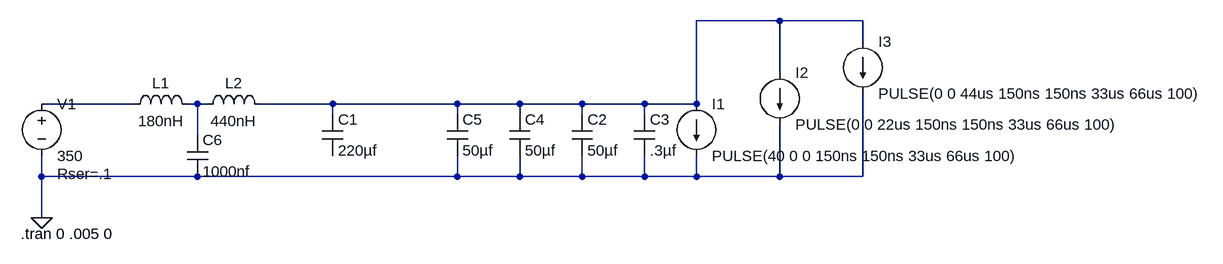
[diagram p0: schematic dc vus caps.asc]
dc vus caps.asc, the LTspice schematic file:
Version 4
SHEET 1 1480 680
WIRE 784 48 656 48
WIRE 912 48 784 48
WIRE 912 80 912 48
WIRE 784 128 784 48
WIRE -208 176 -352 176
WIRE -112 176 -128 176
WIRE -96 176 -112 176
WIRE 96 176 -16 176
WIRE 288 176 96 176
WIRE 384 176 288 176
WIRE 480 176 384 176
WIRE 576 176 480 176
WIRE 656 176 656 48
WIRE 656 176 576 176
WIRE 96 192 96 176
WIRE 288 192 288 176
WIRE 384 192 384 176
WIRE 480 192 480 176
WIRE 576 192 576 176
WIRE -112 224 -112 176
WIRE 96 256 96 240
WIRE -352 288 -352 256
WIRE -112 288 -352 288
WIRE 288 288 288 256
WIRE 288 288 -112 288
WIRE 384 288 384 256
WIRE 384 288 288 288
WIRE 480 288 480 256
WIRE 480 288 384 288
WIRE 576 288 576 256
WIRE 576 288 480 288
WIRE 656 288 656 256
WIRE 656 288 576 288
WIRE 784 288 784 208
WIRE 784 288 656 288
WIRE 912 288 912 160
WIRE 912 288 784 288
WIRE -352 352 -352 288
FLAG -352 352 0
SYMBOL voltage -352 160 R0
WINDOW 123 0 0 Left 0
WINDOW 39 24 124 Left 2
SYMATTR SpiceLine Rser=.1
SYMATTR InstName V1
SYMATTR Value 350
SYMBOL current 656 176 R0
WINDOW 123 0 0 Left 0
WINDOW 39 0 0 Left 0
SYMATTR InstName I1
SYMATTR Value PULSE(40 0 0 150ns 150ns 33us 66us 100)
SYMBOL ind -224 192 R270
WINDOW 0 32 56 VTop 2
WINDOW 3 5 56 VBottom 2
SYMATTR InstName L1
SYMATTR Value 180nH
SYMATTR SpiceLine Rser=.002
SYMBOL cap 80 192 R0
SYMATTR InstName C1
SYMATTR Value 220µf
SYMATTR SpiceLine Rser=480m Lser=20nH
SYMBOL ind -112 192 R270
WINDOW 0 32 56 VTop 2
WINDOW 3 5 56 VBottom 2
SYMATTR InstName L2
SYMATTR Value 440nH
SYMATTR SpiceLine Rser=.002
SYMBOL cap 464 192 R0
SYMATTR InstName C2
SYMATTR Value 50µf
SYMATTR SpiceLine Rser=4.2m Lser=37.5nH
SYMBOL current 784 128 R0
WINDOW 123 0 0 Left 0
WINDOW 39 0 0 Left 0
SYMATTR InstName I2
SYMATTR Value PULSE(0 0 22us 150ns 150ns 33us 66us 100)
SYMBOL current 912 80 R0
WINDOW 123 0 0 Left 0
WINDOW 39 0 0 Left 0
SYMATTR InstName I3
SYMATTR Value PULSE(0 0 44us 150ns 150ns 33us 66us 100)
SYMBOL cap 560 192 R0
SYMATTR InstName C3
SYMATTR Value .3µf
SYMBOL cap 368 192 R0
SYMATTR InstName C4
SYMATTR Value 50µf
SYMATTR SpiceLine Rser=4.2m Lser=37.5nH
SYMBOL cap 272 192 R0
SYMATTR InstName C5
SYMATTR Value 50µf
SYMATTR SpiceLine Rser=4.2m Lser=37.5nH
SYMBOL cap -128 224 R0
SYMATTR InstName C6
SYMATTR Value 1000nf
SYMATTR SpiceLine Lser=15nH
TEXT -384 376 Left 2 !.tran 0 .005 0

The netlist it stands for:
* dc vus caps.asc
V1 N002 0 350 Rser=.1
I1 N001 0 PULSE(40 0 0 150ns 150ns 33us 66us 100)
L1 N002 N003 180nH Rser=.002
C1 N001 N004 220µf Rser=480m Lser=20nH
L2 N003 N001 440nH Rser=.002
C2 N001 0 50µf Rser=4.2m Lser=37.5nH
I2 N001 0 PULSE(0 0 22us 150ns 150ns 33us 66us 100)
I3 N001 0 PULSE(0 0 44us 150ns 150ns 33us 66us 100)
C3 N001 0 .3µf
C4 N001 0 50µf Rser=4.2m Lser=37.5nH
C5 N001 0 50µf Rser=4.2m Lser=37.5nH
C6 N003 0 1000nf Lser=15nH
.tran 0 .005 0
.backanno
.end